# Altium schematic sheet Controller.SchDoc
size A3
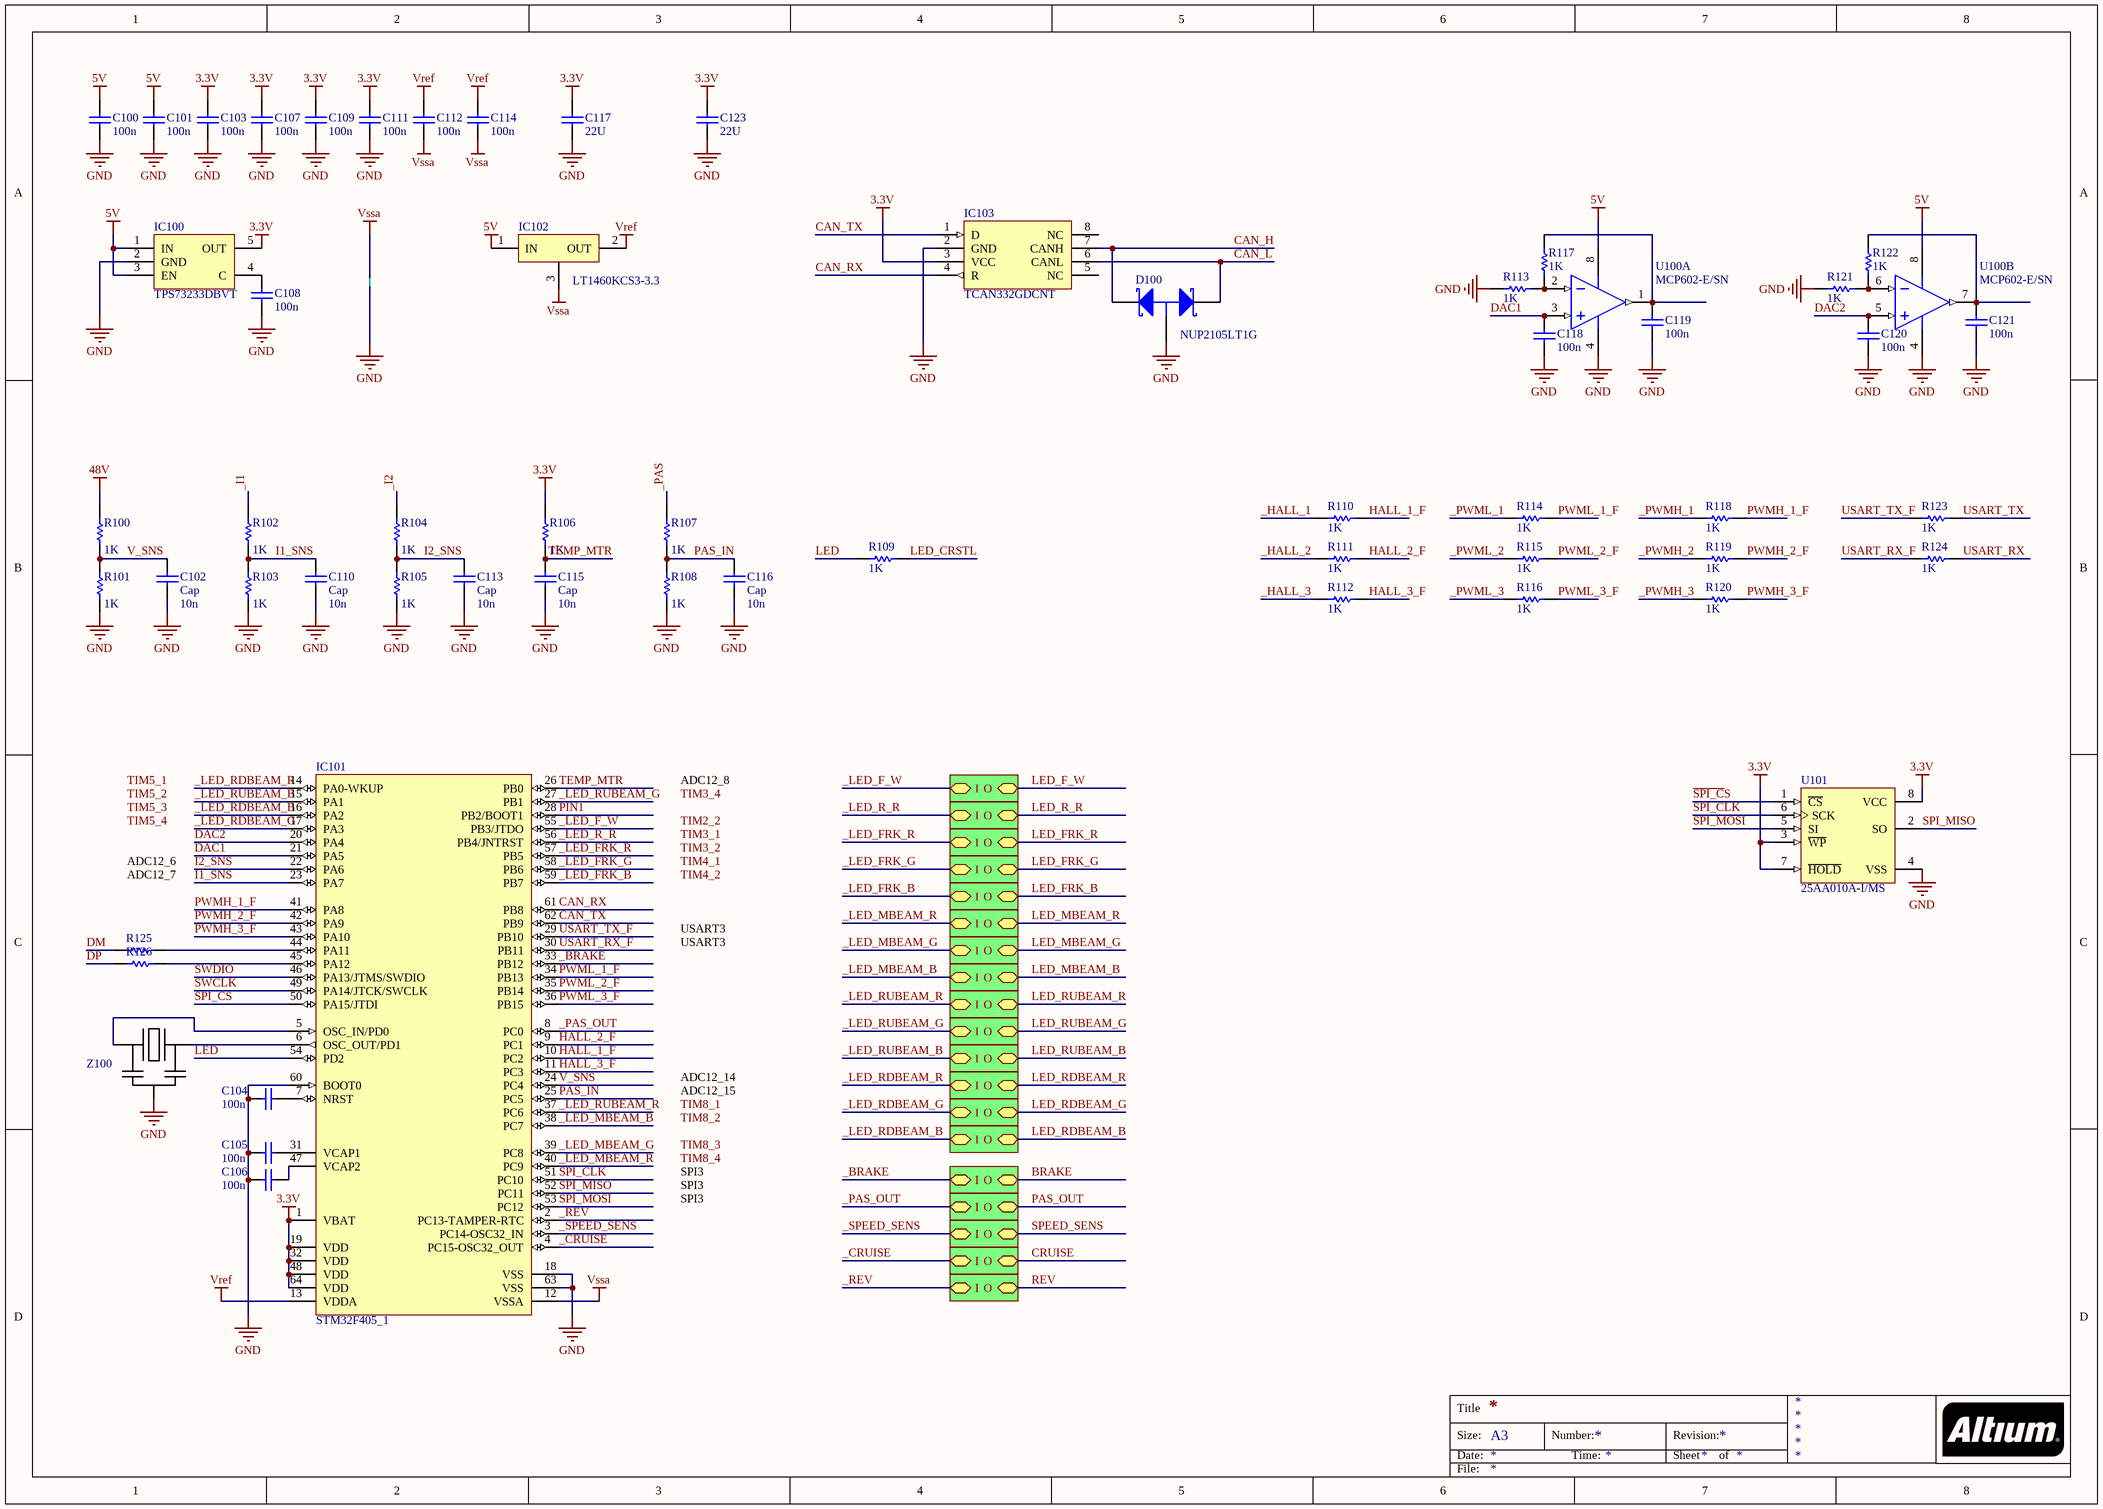
[diagram p0: Controller.SchDoc]

## Parts
C100  value 100n  [0603x]  (hidden comment: Cap)
C101  value 100n  [0603x]  (hidden comment: Cap)
C102  Cap  value 10n  [0603x]
C103  value 100n  [0603x]  (hidden comment: Cap)
C104  value 100n  [0402x]  (hidden comment: Cap)
C105  value 100n  [0603x]  (hidden comment: Cap)
C106  value 100n  [0603x]  (hidden comment: Cap)
C107  value 100n  [0603x]  (hidden comment: Cap)
C108  value 100n  [0603x]  (hidden comment: Cap)
C109  value 100n  [0603x]  (hidden comment: Cap)
C110  Cap  value 10n  [0603x]
C111  value 100n  [0603x]  (hidden comment: Cap)
C112  value 100n  [0603x]  (hidden comment: Cap)
C113  Cap  value 10n  [0603x]
C114  value 100n  [0603x]  (hidden comment: Cap)
C115  Cap  value 10n  [0402x]
C116  Cap  value 10n  [0603x]
C117  value 22U  [RR_B]  (hidden comment: Cap)
C118  value 100n  [0603x]  (hidden comment: Cap)
C119  value 100n  [0603x]  (hidden comment: Cap)
C120  value 100n  [0603x]  (hidden comment: Cap)
C121  value 100n  [0603x]  (hidden comment: Cap)
C123  value 22U  [RR_B]  (hidden comment: Cap)
D100  NUP2105LT1G  [SOT23_M]
IC100  TPS73233DBVT  [SOT23-5_L]
IC101  STM32F405_1  [LQFP64_L]
IC102  LT1460KCS3-3.3  [SOT-23]
IC103  TCAN332GDCNT  [SOT23-8_L]
NT100  NET_TIE  [NET_TIE_20mil]  (value not drawn)  (net tie, no BOM)
R100  value 1K  [0603x]  (hidden comment: Res1)
R101  value 1K  [0603x]  (hidden comment: Res1)
R102  value 1K  [0603x]  (hidden comment: Res1)
R103  value 1K  [0603x]  (hidden comment: Res1)
R104  value 1K  [0603x]  (hidden comment: Res1)
R105  value 1K  [0603x]  (hidden comment: Res1)
R106  value 1K  [0603x]  (hidden comment: Res1)
R107  value 1K  [0603x]  (hidden comment: Res1)
R108  value 1K  [0603x]  (hidden comment: Res1)
R109  value 1K  [0603x]  (hidden comment: Res1)
R110  value 1K  [0603x]  (hidden comment: Res1)
R111  value 1K  [0603x]  (hidden comment: Res1)
R112  value 1K  [0603x]  (hidden comment: Res1)
R113  value 1K  [0603x]  (hidden comment: Res1)
R114  value 1K  [0603x]  (hidden comment: Res1)
R115  value 1K  [0603x]  (hidden comment: Res1)
R116  value 1K  [0603x]  (hidden comment: Res1)
R117  value 1K  [0603x]  (hidden comment: Res1)
R118  value 1K  [0603x]  (hidden comment: Res1)
R119  value 1K  [0603x]  (hidden comment: Res1)
R120  value 1K  [0603x]  (hidden comment: Res1)
R121  value 1K  [0603x]  (hidden comment: Res1)
R122  value 1K  [0603x]  (hidden comment: Res1)
R123  value 1K  [0603x]  (hidden comment: Res1)
R124  value 1K  [0603x]  (hidden comment: Res1)
R125  Res1  [0603x]  (value not drawn)
R126  Res1  [0603x]  (value not drawn)
U100  MCP602-E/SN  [SOIC-SN8_N]  (parts A,B of 2)
U101  25AA010A-I/MS  [SO-8_N]
Z100  AWSCR-8.00CV-T  [CRYSTAL_3.2X1.3]  (value not drawn)

## Sub-sheets
LED = LED_DRV.SchDoc: I, O
LED = LED_DRV.SchDoc: I, O
LED = LED_DRV.SchDoc: I, O
LED = LED_DRV.SchDoc: I, O
LED = LED_DRV.SchDoc: I, O
LED = LED_DRV.SchDoc: I, O
LED = LED_DRV.SchDoc: I, O
LED = LED_DRV.SchDoc: I, O
LED = LED_DRV.SchDoc: I, O
LED = LED_DRV.SchDoc: I, O
LED = LED_DRV.SchDoc: I, O
LED = LED_DRV.SchDoc: I, O
LED = LED_DRV.SchDoc: I, O
LED = LED_DRV.SchDoc: I, O
OK = OK.SchDoc: I, O
OK = OK.SchDoc: I, O
OK = OK.SchDoc: I, O
OK = OK.SchDoc: I, O
OK = OK.SchDoc: I, O

## Nets
3.3V: C103.1 C107.1 C109.1 C111.1 C117.1 C123.1 IC100.5(OUT) IC101.1(VBAT) IC101.19(VDD) IC101.32(VDD) IC101.48(VDD) IC101.64(VDD) IC103.3(VCC) R106.1 U101.3(~{WP}) U101.7(~{HOLD}) U101.8(VCC)
5V: C100.1 C101.1 IC100.1(IN) IC100.3(EN) IC102.1(IN) U100.8(VDD)
48V: R100.1
GND: C100.2 C101.2 C102.2 C103.2 C104.2 C105.2 C106.2 C107.2 C108.2 C109.2 C110.2 C111.2 C113.2 C115.2 C116.2 C117.2 C118.2 C119.2 C120.2 C121.2 C123.2 D100.1(A) IC100.2(GND) IC101.18(VSS) IC101.60(BOOT0) IC101.63(VSS) IC103.2(GND) NT100.1 R101.2 R103.2 R105.2 R108.2 R113.1 R121.1 U100.4(VSS) U101.4(VSS) Z100.2(GND)
Vref: C112.1 C114.1 IC101.13(VDDA) IC102.2(OUT)
Vssa: C112.2 C114.2 IC101.12(VSSA) IC102.3(GND) NT100.2
~{SPI_C}S: IC101.50(PA15/JTDI) U101.1(~{CS})
_BRAKE: IC101.33(PB12) ; sheet OK/I
_CRUISE: IC101.4(PC15-OSC32_OUT) ; sheet OK/I
_HALL_1: R110.1
_HALL_2: R111.1
_HALL_3: R112.1
_I1: R102.1
_I2: R104.1
_LED_F_W: IC101.55(PB3/JTDO) ; sheet LED/I
_LED_FRK_B: IC101.59(PB7) ; sheet LED/I
_LED_FRK_G: IC101.58(PB6) ; sheet LED/I
_LED_FRK_R: IC101.57(PB5) ; sheet LED/I
_LED_MBEAM_B: IC101.38(PC7) ; sheet LED/I
_LED_MBEAM_G: IC101.39(PC8) ; sheet LED/I
_LED_MBEAM_R: IC101.40(PC9) ; sheet LED/I
_LED_R_R: IC101.56(PB4/JNTRST) ; sheet LED/I
_LED_RDBEAM_B: IC101.16(PA2) ; sheet LED/I
_LED_RDBEAM_G: IC101.17(PA3) ; sheet LED/I
_LED_RDBEAM_R: IC101.14(PA0-WKUP) ; sheet LED/I
_LED_RUBEAM_B: IC101.15(PA1) ; sheet LED/I
_LED_RUBEAM_G: IC101.27(PB1) ; sheet LED/I
_LED_RUBEAM_R: IC101.37(PC6) ; sheet LED/I
_PAS: R107.1
_PAS_OUT: IC101.8(PC0) ; sheet OK/I
_PWMH_1: R118.1
_PWMH_2: R119.1
_PWMH_3: R120.1
_PWML_1: R114.1
_PWML_2: R115.1
_PWML_3: R116.1
_REV: IC101.2(PC13-TAMPER-RTC) ; sheet OK/I
_SPEED_SENS: IC101.3(PC14-OSC32_IN) ; sheet OK/I
BRAKE: sheet OK/O
CAN_H: D100.2(K2) IC103.7(CANH)
CAN_L: D100.3(K1) IC103.6(CANL)
CAN_RX: IC101.61(PB8) IC103.4(R)
CAN_TX: IC101.62(PB9) IC103.1(D)
CRUISE: sheet OK/O
DAC1: C118.1 IC101.21(PA5) U100.3(VINA+)
DAC2: C120.1 IC101.20(PA4) U100.5(VINB+)
DM: R125.1
DP: R126.1
HALL_1_F: IC101.10(PC2) R110.2
HALL_2_F: IC101.9(PC1) R111.2
HALL_3_F: IC101.11(PC3) R112.2
I1_SNS: C110.1 IC101.23(PA7) R102.2 R103.1
I2_SNS: C113.1 IC101.22(PA6) R104.2 R105.1
LED: IC101.54(PD2) R109.1
LED_CRSTL: R109.2
LED_F_W: sheet LED/O
LED_FRK_B: sheet LED/O
LED_FRK_G: sheet LED/O
LED_FRK_R: sheet LED/O
LED_MBEAM_B: sheet LED/O
LED_MBEAM_G: sheet LED/O
LED_MBEAM_R: sheet LED/O
LED_R_R: sheet LED/O
LED_RDBEAM_B: sheet LED/O
LED_RDBEAM_G: sheet LED/O
LED_RDBEAM_R: sheet LED/O
LED_RUBEAM_B: sheet LED/O
LED_RUBEAM_G: sheet LED/O
LED_RUBEAM_R: sheet LED/O
PAS_IN: C116.1 IC101.25(PC5) R107.2 R108.1
PAS_OUT: sheet OK/O
PIN1: IC101.28(PB2/BOOT1)
PWMH_1_F: IC101.41(PA8) R118.2
PWMH_2_F: IC101.42(PA9) R119.2
PWMH_3_F: IC101.43(PA10) R120.2
PWML_1_F: IC101.34(PB13) R114.2
PWML_2_F: IC101.35(PB14) R115.2
PWML_3_F: IC101.36(PB15) R116.2
REV: sheet OK/O
SPEED_SENS: sheet OK/O
SPI_CLK: IC101.51(PC10) U101.6(SCK)
SPI_MISO: IC101.52(PC11) U101.2(SO)
SPI_MOSI: IC101.53(PC12) U101.5(SI)
SWCLK: IC101.49(PA14/JTCK/SWCLK)
SWDIO: IC101.46(PA13/JTMS/SWDIO)
TEMP_MTR: C115.1 IC101.26(PB0) R106.2
USART_RX: R124.2
USART_RX_F: IC101.30(PB11) R124.1
USART_TX: R123.2
USART_TX_F: IC101.29(PB10) R123.1
V_SNS: C102.1 IC101.24(PC4) R100.2 R101.1
NetC104_1: C104.1 IC101.7(NRST)
NetC105_1: C105.1 IC101.31(VCAP1)
NetC106_1: C106.1 IC101.47(VCAP2)
NetC108_1: C108.1 IC100.4(C)
NetC119_1: C119.1 R117.2 U100.1(VOUTA)
NetC121_1: C121.1 R122.2 U100.7(VOUTB)
NetIC101_5: IC101.5(OSC_IN/PD0) Z100.1(X1)
NetIC101_6: IC101.6(OSC_OUT/PD1) Z100.3(X2)
NetIC101_44: IC101.44(PA11) R125.2
NetIC101_45: IC101.45(PA12) R126.2
NetR113_2: R113.2 R117.1 U100.2(VINA-)
NetR121_2: R121.2 R122.1 U100.6(VINB-)

Not connected (* = marked no-connect by the designer): IC103 5(NC) 8(NC)

## Notes on the sheet
- ADC12_8
- ADC12_6
- ADC12_7
- USART3
- ADC12_14
- ADC12_15
- SPI3
- Labels drawn without touching a wire or pin: TIM2_2, TIM3_1, TIM3_2, TIM3_4, TIM4_1, TIM4_2, TIM5_1, TIM5_2, TIM5_3, TIM5_4, TIM8_1, TIM8_2, TIM8_3, TIM8_4
- Title
- Size:
- Date:
- A3
- Number:
- Time:
- Revision:
- Sheet
- of
- File:

## Library data of the parts
C100-C121 C123 = Cap: Capacitor; Published: 8-Jun-2000; LatestRevisionDate: 17-Jul-2002; LatestRevisionNote: Re-released for DXP Platform.; PackageReference: RAD-0.3; Publisher: Altium Limited; PackageDescription: Radial Cap, Thru-Hole; 2 Leads; 0.3 in Pin Spacing
D100 = BAT54A: Schottky Barrier Double Diode; LatestRevisionNote: IPC-7351 Footprint Added.; Package: SOT23; PackageDescription: 3-Pin SOT-23 Package 0.95 mm Pitch, 2.3 mm Lead Span; ComponentLink1Description: Manufacturer Link; ComponentLink1URL: http://www.semiconductors.philips.com/; Value: NUP2105LT1G; Distributor: ON Semiconductor; Order Number: NUP2105LT1G
IC100 = TPS7xx33: Value: LDO 3.3V 250mA; Order Number: TPS73233DBVT; Distributor: Texas Instruments; Package: SOT23-5
IC101 = STM32F405_1: STM32 ARM-based 32-bit MCU; Order Number: STM32F405RGT6; Value: STM32F405RGT6; Package: LQFP-64; Distributor: STMicroelectronics
IC102 = PreciseRef: Value: Voltage reference 3.3V 0.5% 50ppm/C; Order Number: LT1460KCS3-3.3#TRMPBF; Package: SOT23; Distributor: Linear Technology
NT100 = Net tie
R100-R124 = Res1: Resistor; Published: 8-Jun-2000; LatestRevisionDate: 17-Jul-2002; LatestRevisionNote: Re-released for DXP Platform.; PackageReference: AXIAL-0.3; Publisher: Altium Limited; PackageDescription: Axial Device, Thru-Hole; 2 Leads; 0.3 in Pin Spacing
R125 R126 = Res1: Resistor; Value: 1K; Published: 8-Jun-2000; LatestRevisionDate: 17-Jul-2002; LatestRevisionNote: Re-released for DXP Platform.; PackageReference: AXIAL-0.3; Publisher: Altium Limited; PackageDescription: Axial Device, Thru-Hole; 2 Leads; 0.3 in Pin Spacing
U100 = MCP602-E/SN: 2.7V to 6.0V Single Supply CMOS Operational Amplifier, 8-Pin SOIC, Extended Temperature; Published: 29-Jan-2009; DatasheetVersion: revG, Dec-2007; PackageVersion: revBB, Aug-2009; PackageReference: SOIC-SN8; Publisher: Altium Limited; PackageDescription: 8-Lead Plastic Small Outline (SN) - Narrow, 3.90mm Body [SOIC]; Supplier 1: Digi-Key; Supplier Part Number 1: MCP602-E/SN-ND; Code_JEDEC: MS-012; Code_IPC: SOIC127P600-8; ComponentLink1Description: Datasheet; ComponentLink1URL: http://ww1.microchip.com/downloads/en/DeviceDoc/21314g.pdf; ComponentLink2Description: Packaging Specification; ComponentLink2URL: http://www.microchip.com/stellent/groups/techpub_sg/documents/packagingspec/en012702.pdf; ComponentLink3Description: Microchip.com Home; ComponentLink3URL: http://www.microchip.com/
U101 = 25AA010A-I/MS: 1K SPI Bus Serial EEPROM, 8-Pin MSOP, Industrial Temperature; Published: 29-Jan-2009; LatestRevisionDate: 02-Dec-2009; LatestRevisionNote: Updated to datasheet revision E, Jan-2008; DatasheetVersion: revE, Sep-2008; PackageVersion: revBB, Aug-2009; PackageReference: MSOP-MS8; Publisher: Altium Limited; PackageDescription: 8-Lead Plastic Micro Small Outline Package (MS) [MSOP]; Supplier 1: Digi-Key; Supplier Part Number 1: 25AA010A-I/MS-ND; Supplier 2: Farnell; Supplier Part Number 2: 1331337; ComponentLink1Description: Datasheet; ComponentLink1URL: http://ww1.microchip.com/downloads/en/DeviceDoc/21832E.pdf; ComponentLink2Description: Packaging Specification; ComponentLink2URL: http://www.microchip.com/stellent/groups/techpub_sg/documents/packagingspec/en012702.pdf; ComponentLink3Description: Microchip.com Home; ComponentLink3URL: http://www.microchip.com/
Z100 = Crystal_smd_with_caps: Value: CER RES 8.0000MHZ 22PF SMD; Order Number: AWSCR-8.00CV-T; Distributor: Abracon LLC; Package: 3-SMD, Non-Standard
IC103 = TCAN332GDCNT: Order Number: TCAN332GDCNT; Package: SOT23-8; Value: TCAN332GDCNT; Distributor: Texas Instruments